# EAGLE design Reference_Adapter (EAGLE 6.6.0)
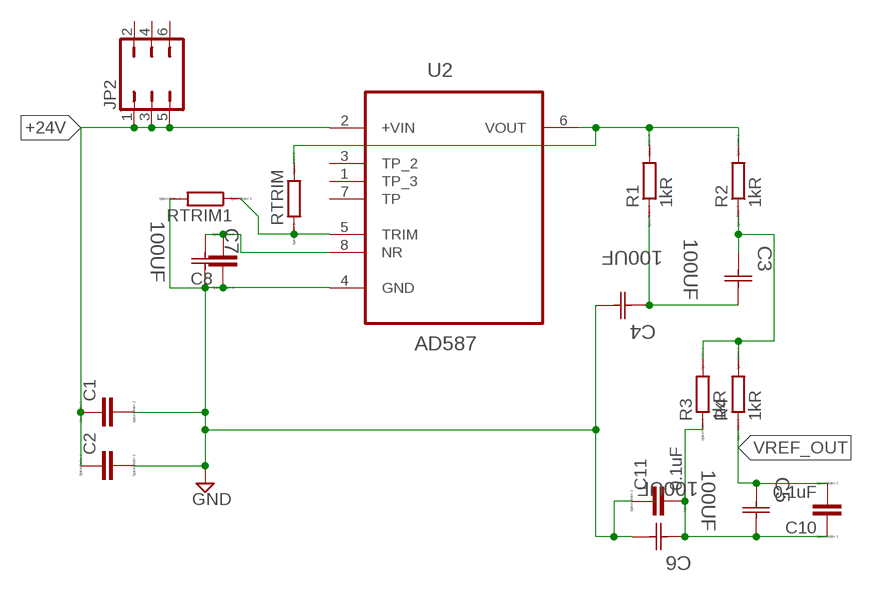
[diagram p0: schematic, sheet 1]

## Parts
C1  C  [C0805]
C2  CC0603  [C0603]
C3  100UF  TPSE107M020R0150  [CAPCP7343X430N]
C4  100UF  TPSE107M020R0150  [CAPCP7343X430N]
C5  100UF  TPSE107M020R0150  [CAPCP7343X430N]
C6  100UF  TPSE107M020R0150  [CAPCP7343X430N]
C7  100UF  TPSE107M020R0150  [CAPCP7343X430N]
C8  C  [C0805]
C10  0.1uF  CC0603  [C0603]
C11  0.1uF  CC0603  [C0603]
JP2  JP3Q  [JP3Q]
R1  1kR  R  [R0805]
R2  1kR  R  [R0805]
R3  1kR  R  [R0805]
R4  1kR  R  [R0805]
RTRIM  R  [R0805]
RTRIM1  R  [R0805]
U2  AD587  AD587JRZ  [SOIC127P600X175-8N]

## Nets
+24V: C1.1 C2.1 JP2.1 JP2.3 JP2.5 U2.2(+VIN)
GND: C1.2 C2.2 C4.2 C6.2 C7.2 C8.1 C11.1 RTRIM1.2 U2.4(GND)
N$1: C3.2 C4.1 R1.1
N$2: RTRIM1.1 RTRIM.1 U2.5(TRIM)
N$3: R1.2 R2.2 RTRIM.2 U2.6(VOUT)
N$4: C7.1 C8.2 U2.8(NR)
N$5: C3.1 R2.1 R3.2 R4.2
N$7: C5.2 C6.1 C10.1 C11.2 R3.1
VREF_OUT: C5.1 C10.2 R4.1
Unconnected: JP2.2 JP2.4 JP2.6 U2.1(TP_3) U2.3(TP_2) U2.7(TP)

## Library data of the parts
C1 C2 C8 C10 C11 = eagle-ltspice:C: CAPACITOR, European symbol; SPICEMODEL: NONE; SPICEPREFIX: C
C3-C7 = AVX_By_element14_Batch_1:TPSE107M020R0150: Tantalum Capacitor , 2917; CAPACITANCETOLERANCE: ±20%; MPN: TPSE107M020R0150; OC_FARNELL: 1762583; OC_NEWARK: 75M2977; SUPPLIER: AVX; VOLTAGERATING: 20V
JP2 = jumper:JP3Q: JUMPER
R1-R4 RTRIM RTRIM1 = eagle-ltspice:R: RESISTOR, European symbol; SPICEMODEL: NONE; SPICEPREFIX: R
U2 = Analog Devices_By_element14_Batch_1:AD587JRZ: High Precision 10 V Reference; MPN: AD587JRZ; OC_FARNELL: -; OC_NEWARK: 19M0842; PACKAGE: SOIC-8; SUPPLIER: Analog Devices

## Board
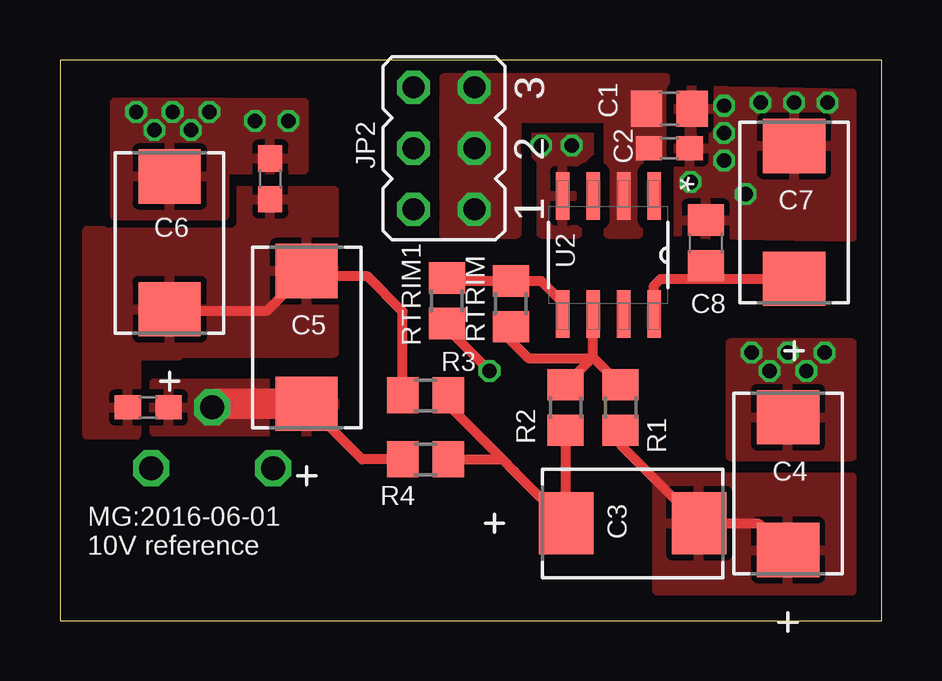
[diagram p1: board, top side]
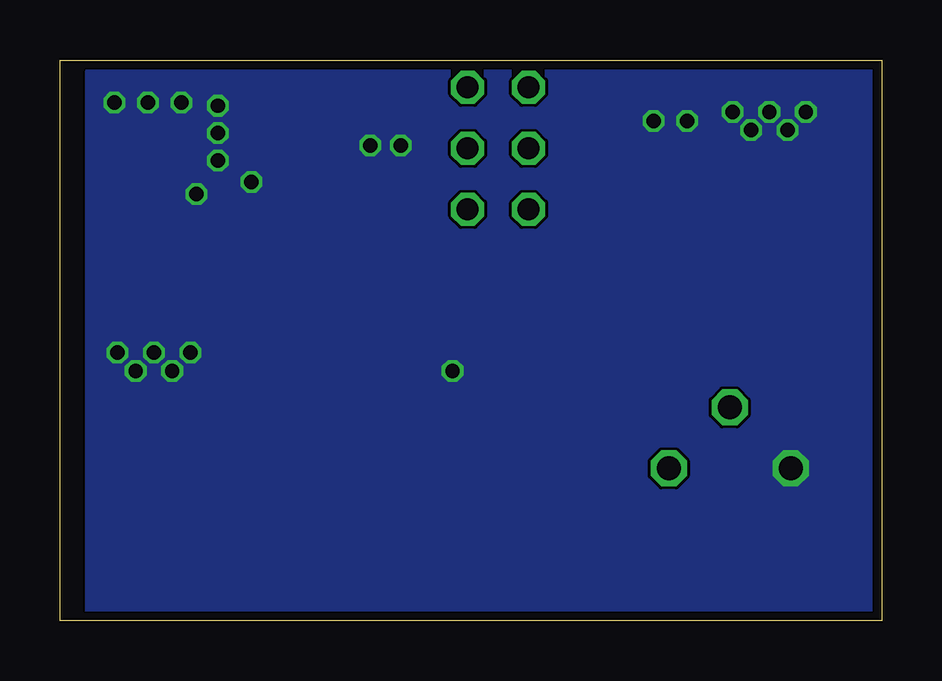
[diagram p2: board, bottom side, seen from below]

Size 34.27 x 23.37 mm. Coordinates in mm from the lower left corner, seen from the top.
Outline: 0,0 34.27,0 34.27,23.37 0,23.37 0,0
Copper layers (1*16): Top 0.035559375mm / dielectric 0.17018125mm / Bottom 0.035559375mm
Design rules "OSHPark-4layer *": minimum track width 5mil, minimum drill 10mil, track to track 5mil, track to pad 5mil, pad to pad 5mil, via to via 5mil, smd to smd 5mil, copper to edge 15mil, drill to drill 6mil, minimum pad ring 4mil, minimum via ring 4mil, stop-mask expansion 2.5mil, vias tented up to drill 0mil, thermal gap 10mil

### Footprints (pad centres in the part's own frame; a part is rotated, then mirrored left to right if it is on the bottom)
C0805 = smd 1.3 x 1.5: 1 -0.95,0; 2 0.95,0
C0603 = smd 1.1 x 1: 1 -0.85,0; 2 0.85,0
CAPCP7343X430N = smd 2.261 x 2.591: 1 -2.769,0; 2 2.769,0
JP3Q = drill 0.914 octagon: 1 -2.54,-1.27; 2 -2.54,1.27; 3 0,-1.27; 4 0,1.27; 5 2.54,-1.27; 6 2.54,1.27
R0805 = smd 1.3 x 1.5: 1 -0.95,0; 2 0.95,0
SOIC127P600X175-8N = smd 1.981 x 0.559: 1 -2.464,1.905; 2 -2.464,0.635; 3 -2.464,-0.635; 4 -2.464,-1.905; 5 2.464,-1.905; 6 2.464,-0.635; 7 2.464,0.635; 8 2.464,1.905

### Placement (x,y rotation side)
C1  25.4,21.34 0 top
C2  25.4,19.68 0 top
C3  23.88,4.06 0 top
C4  30.35,5.71 90 top
C5  10.29,11.81 90 top
C6  4.57,15.75 90 top
C7  30.61,17.02 90 top
C8  26.92,15.75 270 top
C10  3.68,8.89 0 top
C11  8.76,18.41 270 top
JP2  16,19.68 90 top
R1  23.37,8.89 90 top
R2  21.08,8.89 90 top
R3  15.24,9.4 0 top
R4  15.24,6.73 0 top
RTRIM  18.8,13.21 270 top
RTRIM1  16.13,13.34 270 top
U2  22.86,15.24 270 top

### Tracks (layer width: path | path; a pad name or v marks a point on that pad's centre or on a via)
+24V
  pour Top (isolate 0.406, no thermals): 16,16.13 19.05,16.13 19.05,20.95 22.86,20.95 22.86,16.13 24.13,16.13 24.13,19.43 25.27,19.43 25.27,22.61 16,22.61
GND  (via drill 0.6, 1)
  Top 0.406: RTRIM1.2 16.13,12.19 v17.91,10.41
  other vias: 21.34,19.81 28.83,11.18 3.81,6.35 20.07,19.81 27.69,21.46 27.69,20.32 27.69,19.18 30.35,11.18 31.88,11.18 31.11,10.41 29.59,10.41 3.17,21.21 4.7,21.21 6.22,21.21 5.46,20.45 3.94,20.45 29.21,21.59 30.61,21.59 32,21.59 26.29,18.29 28.57,17.78 9.53,20.83 8.13,20.83
  pour Bottom: 0,0 33.02,0 33.02,22.86 0,22.86
  pour Top (isolate 0.406, rank 3): 20.07,16.13 21.59,16.13 21.59,19.05 22.1,19.56 22.1,20.32 19.68,20.32 19.68,19.56 20.07,19.18
  pour Top (isolate 0.305, rank 2): 25.78,22.1 25.78,16.13 33.02,16 33.02,21.97
  pour Top (isolate 0.305, rank 2): 27.94,6.86 33.02,6.86 33.02,11.56 27.94,11.56
  pour Top (isolate 0.305): 2.29,16.89 6.86,16.89 6.86,21.59 2.29,21.59
  pour Top: 9.91,18.8 6.22,18.8 6.22,21.59 10.16,21.59 10.16,18.8
N$1
  Top 0.406: R1.1 23.37,7.34 C3.2 29.11,4.06 C4.1
  pour Top (isolate 0.305): 24.89,5.97 24.89,1.27 33.02,1.27 33.02,5.97
N$2
  Top 0.406: U2.5 20.95,13.27 20.07,14.16 RTRIM.1 16.13,14.16 RTRIM1.1
N$3
  Top 0.406: 22.23,10.98 U2.6 | 22.23,10.98 22.13,10.89 | 22.13,10.89 R2.2 | 22.23,10.98 R1.2 | 22.13,10.89 22.1,10.92 19.56,10.92 18.29,12.19 RTRIM.2
N$4
  Top 0.406: U2.8 24.77,13.97 25.04,14.25 26.67,14.25 | 26.67,14.25 C7.1 | C8.2 26.67,14.54 26.67,14.25
N$5
  Top 0.406: R2.1 21.08,4.09 C3.1 18.94,6.24 18.44,6.73 | R4.2 18.44,6.73 | R3.2 16.19,8.98 18.44,6.73
N$6  (via drill 1)
  other vias: 8.89,6.35
N$7
  Top 0.406: R3.1 14.29,12.89 12.83,14.35 10.52,14.35 C5.2 8.64,12.93 4.62,12.93 C6.1
  pour Top (isolate 0.305, rank 2): 2.29,17.91 2.29,11.18 11.43,11.18 11.43,17.91
  pour Top (isolate 0.305, rank 2): 3.17,7.75 1.14,7.75 1.14,16.26 4.95,16.26 4.95,11.05 3.17,11.05
VREF_OUT  (via drill 1)
  Top 0.406: R4.1 12.6,6.73 C5.1
  Top 1.27: C5.1 6.5,9.04 v6.35,8.89
  pour Top: 3.94,9.91 11.43,9.91 11.43,7.87 3.94,7.87

### Text on the board
tNames: MG:2016-06-01 / 10V reference